# EAGLE design SHABlindRfShield (EAGLE 6.5.0)
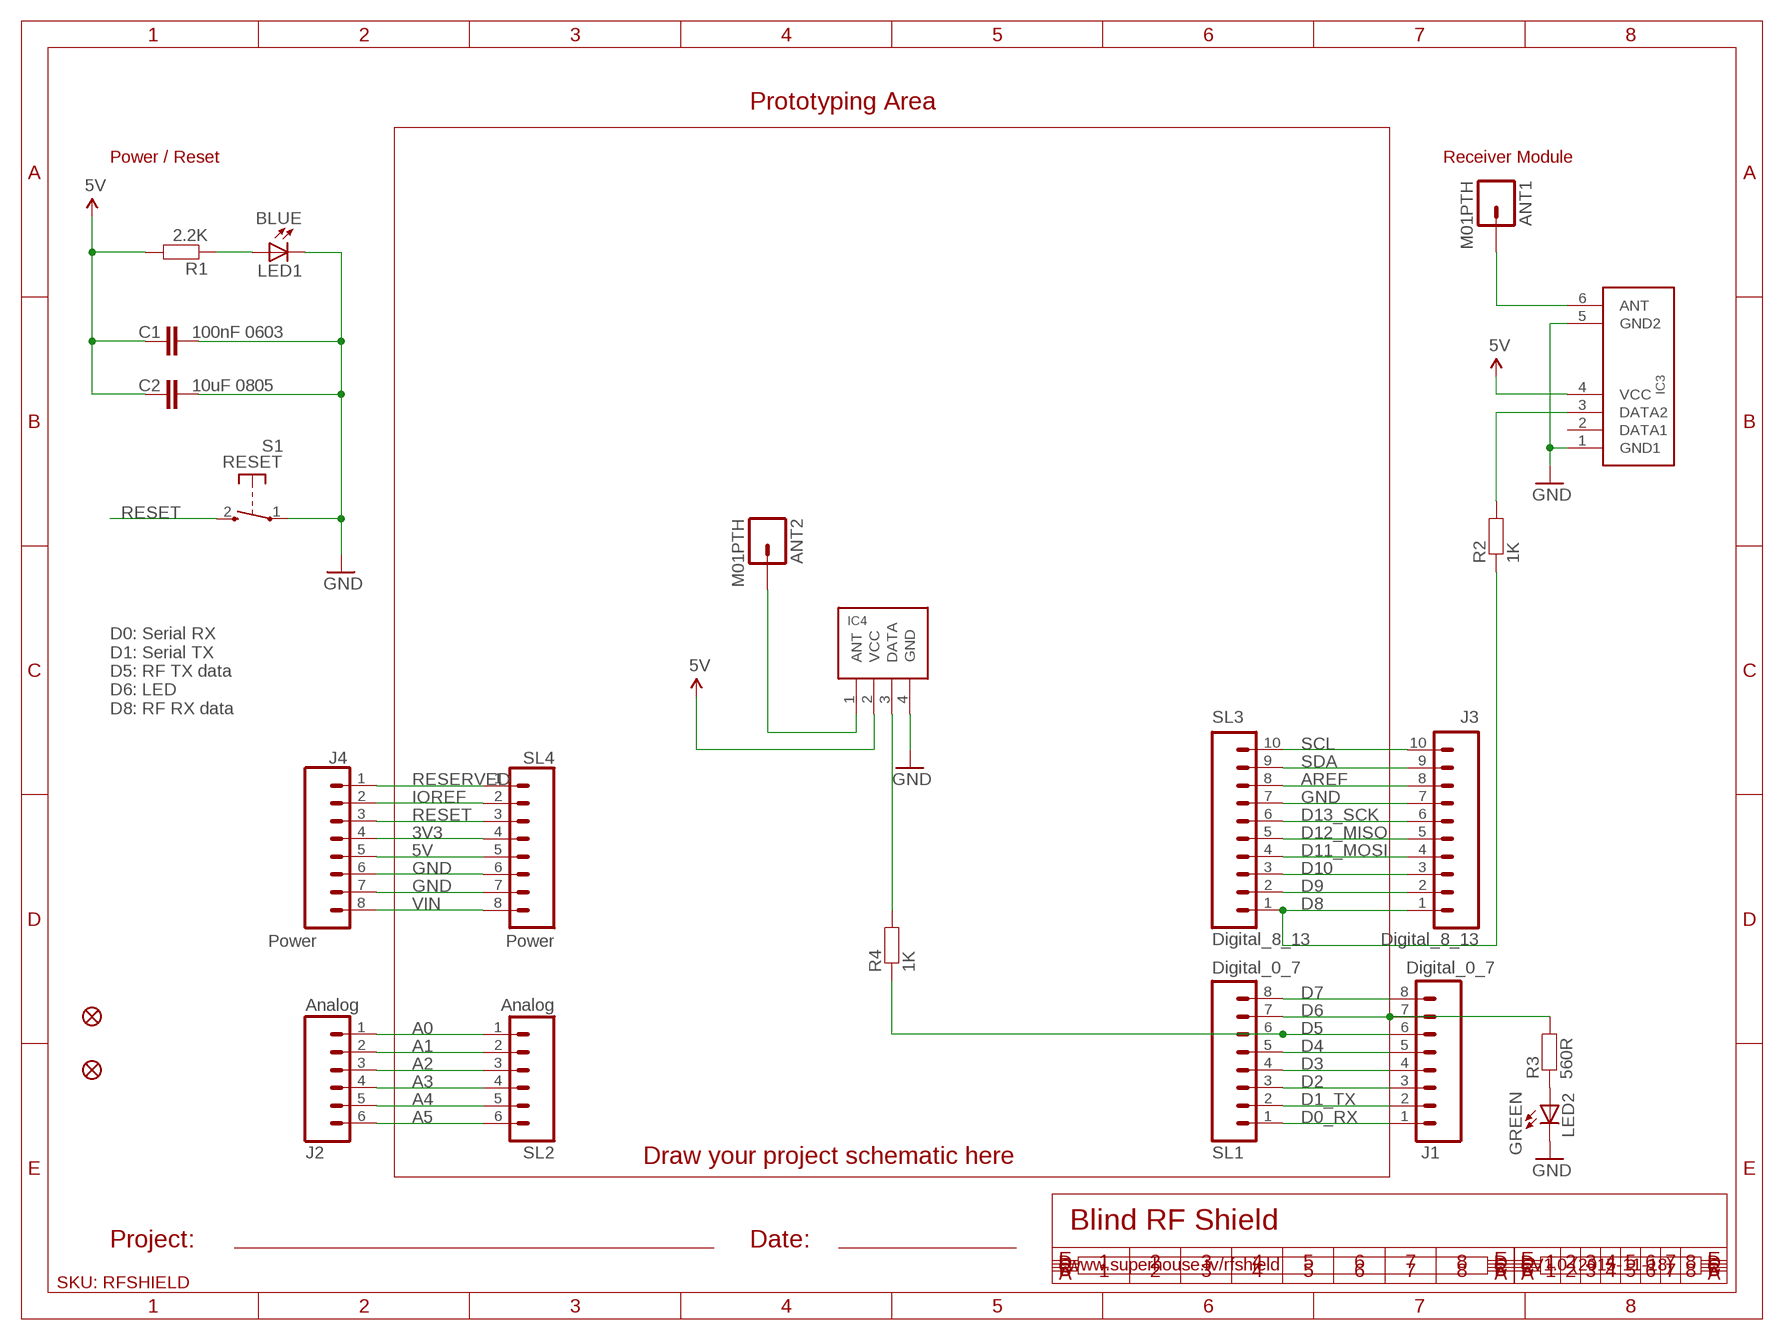
[diagram p0: schematic, sheet 1]

## Parts
ANT1  M01PTH  [1X01]
ANT2  M01PTH  [1X01]
C1  100nF 0603  CAP0603  [0603]
C2  10uF 0805  C-EUC0805  [C0805]
IC3  RXB1  RXB1SHORTFLAT  [RX-B1-SHORT-FLAT]
IC4  TX-C1FLAT  [TX-C1-FLAT]
J1  Digital_0_7  M08  [1X08]
J2  Analog  M06SIP  [1X06]
J3  Digital_8_13  M100.1  [1X10]
J4  Power  M08  [1X08]
LED1  BLUE  LED0603  [LED-0603]
LED2  GREEN  LED0603  [LED-0603]
R1  2.2K  RESISTOR0603  [0603]
R2  1K  RESISTOR0603  [0603]
R3  560R  RESISTOR0603  [0603]
R4  1K  RESISTOR0603  [0603]
S1  RESET  TAC_SWITCH_2PIN  [TACTILE_SWITCH_SMD_2PIN_TINY]
SL1  Digital_0_7  M08  [1X08]
SL2  Analog  M06SIP  [1X06]
SL3  Digital_8_13  M100.1  [1X10]
SL4  Power  M08  [1X08]
U$4  FIDUCIAL1X2.5  [FIDUCIAL-1X2.5]
U$5  FIDUCIAL1X2.5  [FIDUCIAL-1X2.5]

## Nets
3V3: J4.4 SL4.4
5V: C1.1 C2.2 IC3.4(VCC) IC4.2(VCC) J4.5 R1.2 SL4.5
A0: J2.1 SL2.1
A1: J2.2 SL2.2
A2: J2.3 SL2.3
A3: J2.4 SL2.4
A4: J2.5 SL2.5
A5: J2.6 SL2.6
AREF: J3.8 SL3.8
D0_RX: J1.1 SL1.1
D1_TX: J1.2 SL1.2
D2: J1.3 SL1.3
D3: J1.4 SL1.4
D4: J1.5 SL1.5
D5: J1.6 R4.1 SL1.6
D6: J1.7 R3.2 SL1.7
D7: J1.8 SL1.8
D8: J3.1 R2.1 SL3.1
D9: J3.2 SL3.2
D10: J3.3 SL3.3
D11_MOSI: J3.4 SL3.4
D12_MISO: J3.5 SL3.5
D13_SCK: J3.6 SL3.6
GND: C1.2 C2.1 IC3.1(GND1) IC3.5(GND2) IC4.4(GND) J3.7 J4.6 J4.7 LED1.C LED2.C S1.1(P) SL3.7 SL4.6 SL4.7
IOREF: J4.2 SL4.2
N$1: LED1.A R1.1
N$2: LED2.A R3.1
N$3: ANT1.1 IC3.6(ANT)
N$4: ANT2.1 IC4.1(ANT)
N$6: IC4.3(DATA) R4.2
N$135: IC3.3(DATA2) R2.2
RESERVED: J4.1 SL4.1
RESET: J4.3 S1.2(S) SL4.3
SCL: J3.10 SL3.10
SDA: J3.9 SL3.9
VIN: J4.8 SL4.8
Unconnected: IC3.2(DATA1)

## Notes on the sheet
- Prototyping Area
- Power / Reset | Receiver Module
- D0: Serial RX
  D1: Serial TX
  D5: RF TX data
  D6: LED
  D8: RF RX data
- Draw your project schematic here
- Blind RF Shield
- Project: | Date:
- www.superhouse.tv/rfshield | V1.0 (2015-11-18)
- SKU: RFSHIELD

## Library data of the parts
ANT1 ANT2 = freetronics:M01: Header 1 Standard 1-pin 0.1" header. Use with straight break away headers (SKU : PRT-00116), right angle break away headers (PRT-00553), swiss pins (PRT-00743), machine pins (PRT-00117), and female headers (PRT-00115).
C1 = freetronics:CAP: Capacitor Standard 0603 ceramic capacitor, and 0.1" leaded capacitor.
C2 = freetronics-jon:C-EU: CAPACITOR, European symbol
IC3 = freetronics-master-v1:RXB1SHORT
IC4 = freetronics-jon:TX-C1
J1 J4 SL1 SL4 = freetronics:M08: Header 8 Standard 8-pin 0.1" header. Use with straight break away headers (SKU : PRT-00116), right angle break away headers (PRT-00553), swiss pins (PRT-00743), machine pins (PRT-00117), and female headers (PRT-00115).
J2 SL2 = freetronics:M06: Header 6 Standard 6-pin 0.1" header. Use with straight break away headers (SKU : PRT-00116), right angle break away headers (PRT-00553), swiss pins (PRT-00743), machine pins (PRT-00117), and female headers (PRT-00115). Molex polarized connector foot print use with SKU : PRT-08094 with associated crimp pins and housings. NOTES ON THE VARIANTS LOCK and LOCK_LONGPADS... This footprint was designed to help hold the alignment of a through-hole component (i.e. 6-pin header) while soldering it into place. You may notice that each hole has been shifted either up or down by 0.005 of an inch from it's more standard position (which is a perfectly straight line). This slight alteration caused the pins (the squares in the middle) to touch the edges of the holes. Because they are alternating, it causes a "brace" to hold the component in place. 0.005 has proven to be the perfect amount of "off-center" position when using our standard breakaway headers. Although looks a little odd when you look at the bare footprint, once you have a header in there, the alteration is very hard to notice. Also, if you push a header all the way into place, it is covered up entirely on the bottom side. This idea of altering the position of holes to aid alignment will be further integrated into the Sparkfun Library for other footprints. It can help hold any component with 3 or more connection pins.
J3 SL3 = freetronics-original:M10: Header 10 Standard 10-pin 0.1" header. Use with straight break away headers (SKU : PRT-00116), right angle break away headers (PRT-00553), swiss pins (PRT-00743), machine pins (PRT-00117), and female headers (PRT-00115).
LED1 LED2 = freetronics:LED: LEDs Standard schematic elements and footprints for 5mm, 3mm, 1206, and 0603 sized LEDs. 5mm - Spark Fun Electronics SKU : COM-00529 (and others)
R1-R4 = freetronics:RESISTOR: Resistor Basic schematic elements and footprints for 0603, 1206, and PTH 1/10th watt (small) resistors.
S1 = freetronics-jon:TAC_SWITCH_2PIN: Momentary Tactile Switch - 2 pin
U$4 U$5 = freetronics-original:FIDUCIAL: Fiducial Alignment Points Various fiducial points for machine vision alignment.

## Net classes
1 VCC: width 0.305 mm

## Board
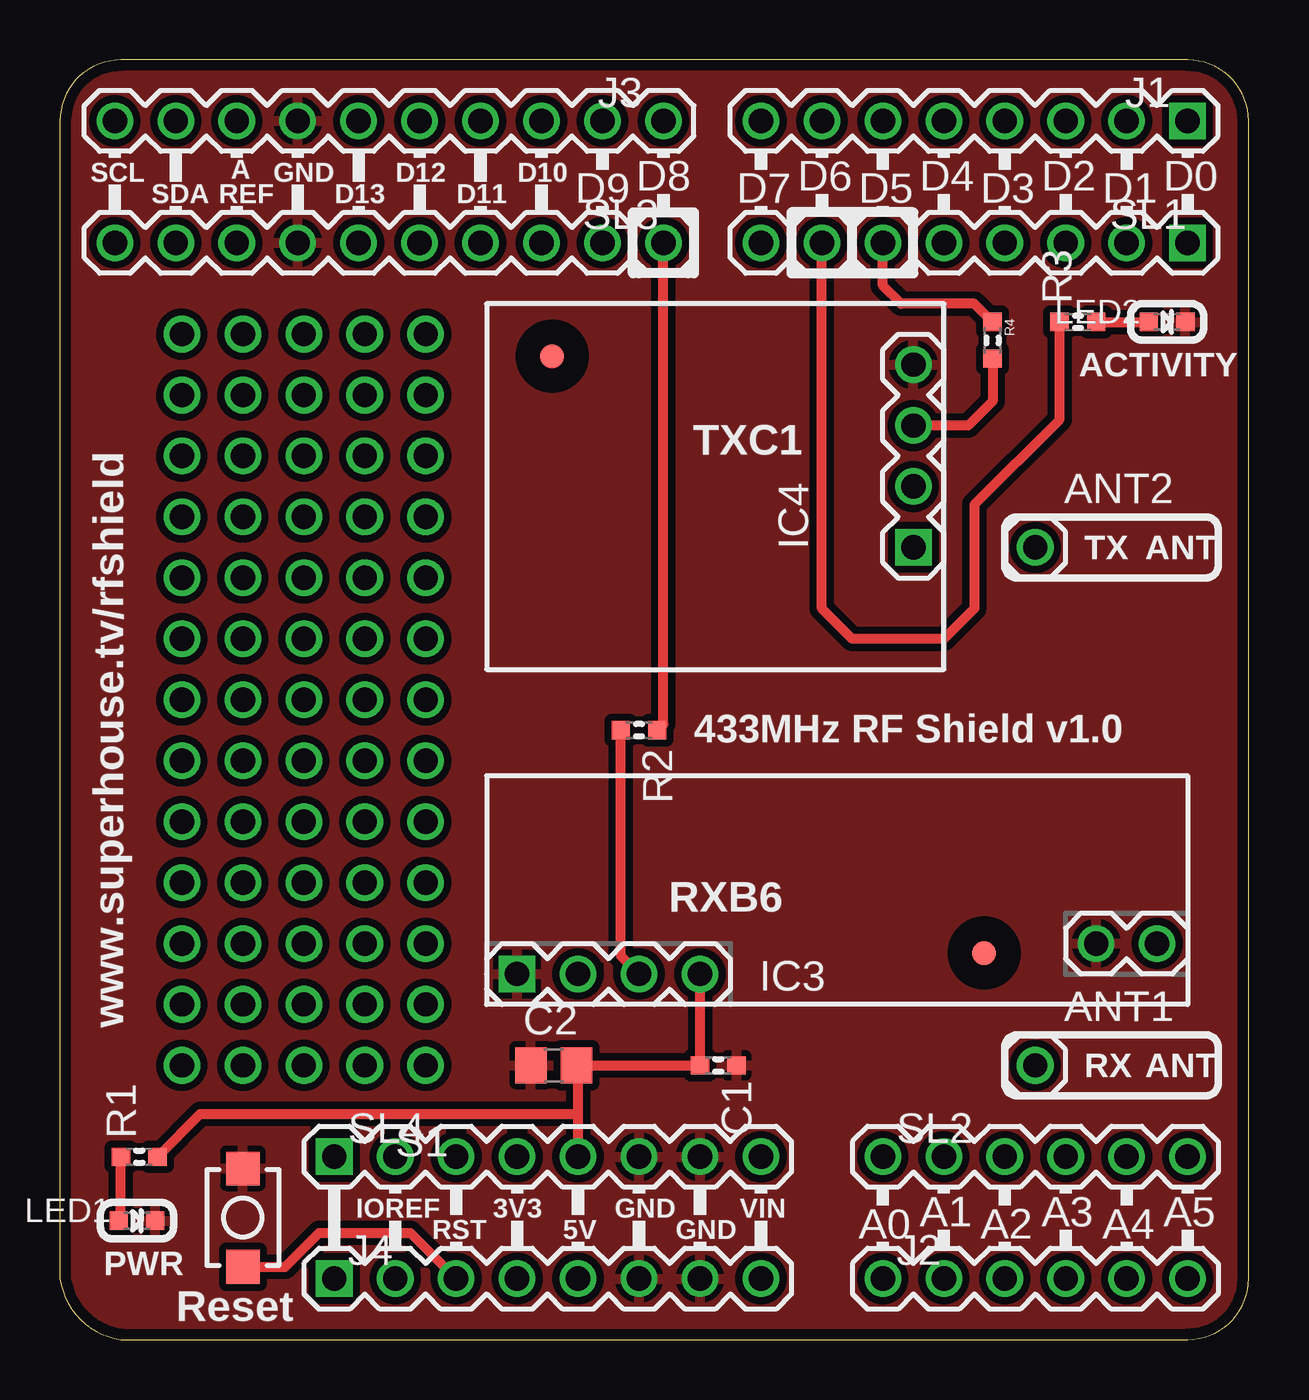
[diagram p1: board, top side]
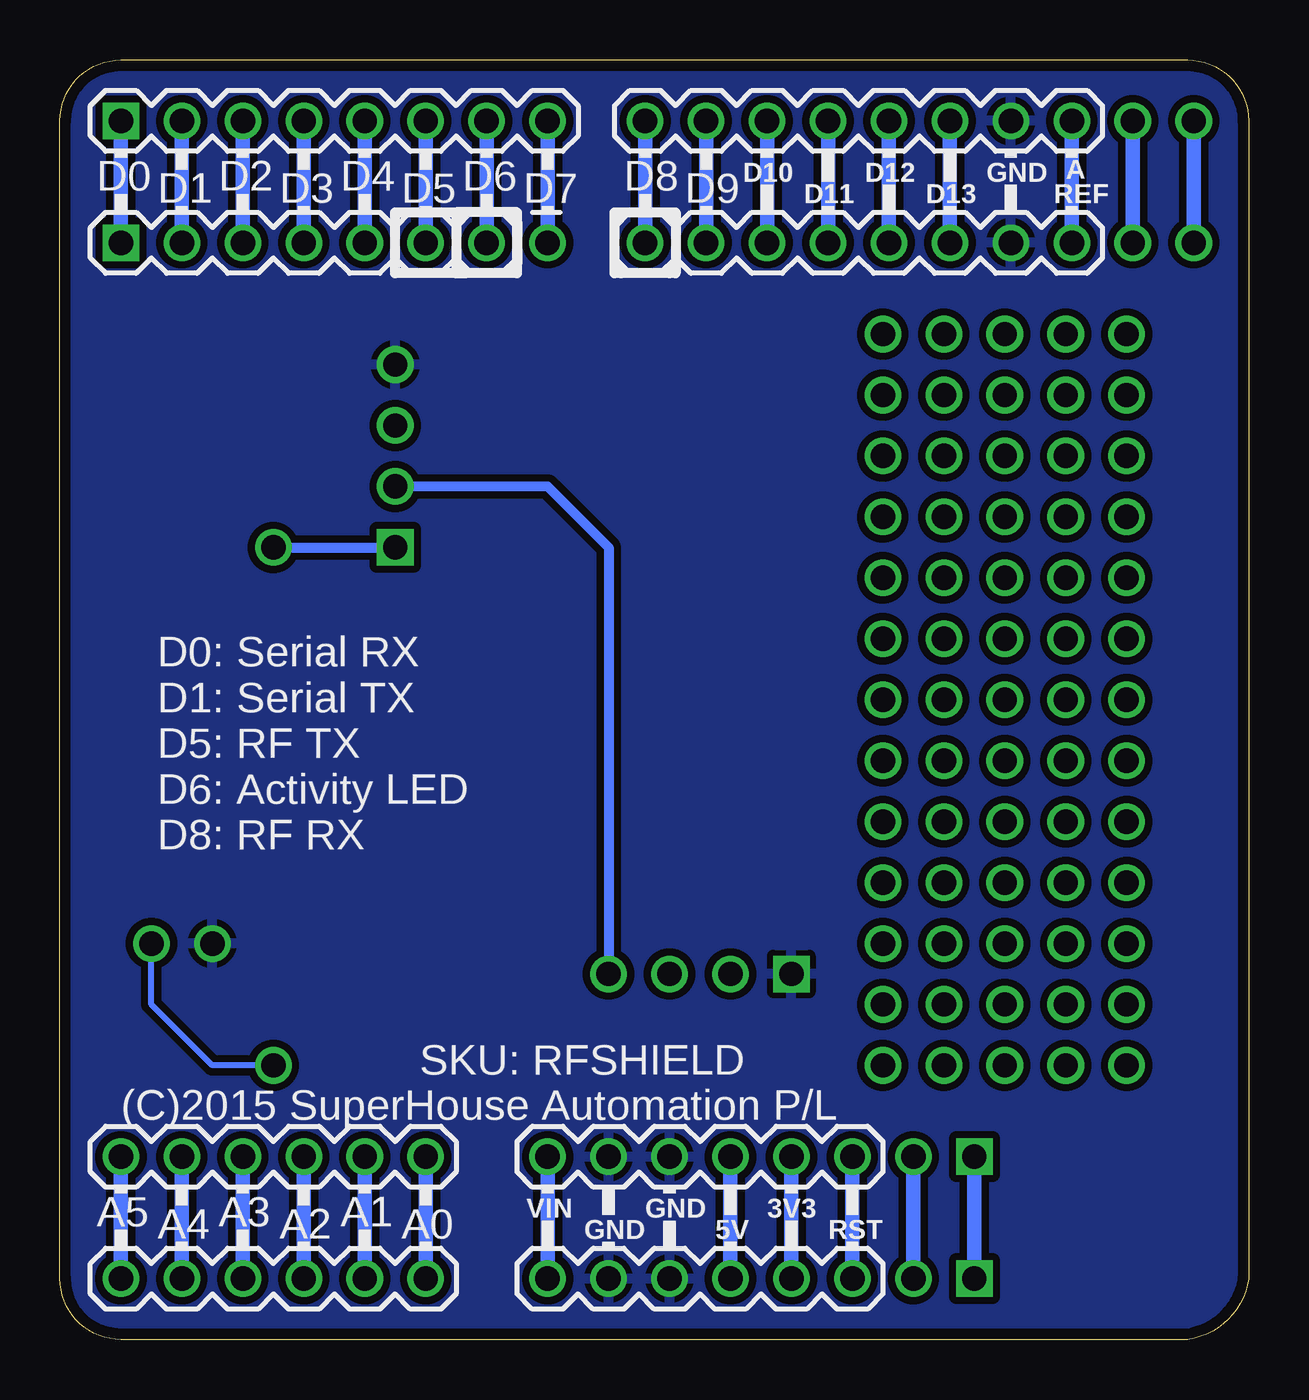
[diagram p2: board, bottom side, seen from below]

Size 49.53 x 53.34 mm. Coordinates in mm from the lower left corner, seen from the top.
Outline: 0,2.54 arc74 2.54,0 46.99,0 arc90 49.53,2.54 49.53,50.8 arc90 46.99,53.34 2.54,53.34 arc90 0,50.8 0,2.54
Copper layers (1*16): Top 0.035mm / dielectric 1.5mm / Bottom 0.035mm
Design rules "default *": minimum track width 10mil, minimum drill 24mil, track to track 12mil, track to pad 12mil, pad to pad 12mil, via to via 12mil, smd to smd 8mil, copper to edge 18mil, drill to drill 8mil, minimum pad ring 10mil, minimum via ring 8mil, stop-mask expansion 4mil, vias tented up to drill 0mil, thermal gap 10mil
tRestrict: area 37.5,15.1 to 39.5,17.1; area 19.5,40 to 21.5,42

### Footprints (pad centres in the part's own frame; a part is rotated, then mirrored left to right if it is on the bottom)
1X01 = drill 1.016: 1 0,0
0603 = smd 0.762 x 0.762: 1 -0.762,0; 2 0.762,0
C0805 = smd 1.3 x 1.5: 1 -0.95,0; 2 0.95,0
RX-B1-SHORT-FLAT = drill 1.016 square: 1 0,0 | drill 1.016: 2 2.54,0; 3 5.08,0; 4 7.62,0; 5 24.13,1.27; 6 26.67,1.27
TX-C1-FLAT = drill 1.016 square: 1 0,0 | drill 1.016: 2 2.54,0; 3 5.08,0; 4 7.62,0
1X08 = drill 1.016 square: 1 0,0 | drill 1.016: 2 2.54,0; 3 5.08,0; 4 7.62,0; 5 10.16,0; 6 12.7,0; 7 15.24,0; 8 17.78,0
1X06 = drill 1.016: 1 0,0; 2 2.54,0; 3 5.08,0; 4 7.62,0; 5 10.16,0; 6 12.7,0
1X10 = drill 1.016: 1 0,0; 2 2.54,0; 3 5.08,0; 4 7.62,0; 5 10.16,0; 6 12.7,0; 7 15.24,0; 8 17.78,0; 9 20.32,0; 10 22.86,0
LED-0603 = smd 0.762 x 0.762: A -0.762,0; C 0.762,0
TACTILE_SWITCH_SMD_2PIN_TINY = smd 1.4 x 1.4: 1 -2.05,0; 2 2.05,0
FIDUCIAL-1X2.5 = smd 1 x 1: 1 0,0

### Placement (x,y rotation side)
ANT1  40.64,11.43 0 top
ANT2  40.64,33.02 0 top
C1  27.43,11.43 0 top
C2  20.57,11.43 0 top
IC3  19.05,15.24 0 top
IC4  35.56,33.02 90 top
J1  46.99,50.8 180 top
J2  34.29,2.54 0 top
J3  25.15,50.8 180 top
J4  11.43,2.54 0 top
LED1  3.21,4.95 0 top
LED2  46.13,42.42 0 top
R1  3.3,7.62 0 top
R2  24.13,25.4 180 top
R3  42.42,42.42 180 top
R4  38.86,41.66 270 top
S1  7.62,5.08 270 top
SL1  46.99,45.72 180 top
SL2  34.29,7.62 0 top
SL3  25.15,45.72 180 top
SL4  11.43,7.62 0 top
U$4  38.51,16.11 270 top
U$5  20.51,40.99 270 top

### Tracks (layer width: path | path; a pad name or v marks a point on that pad's centre or on a via)
3V3
  Bottom 0.61: SL4.4 J4.4
5V
  Top 0.406: SL4.5 21.59,9.4 | 21.59,9.4 21.59,11.36 C2.2 C1.1 IC3.4 | R1.2 5.84,9.4 21.59,9.4
  Bottom 0.406: IC3.4 26.67,33.02 29.21,35.56 IC4.2
  Bottom 0.61: J4.5 SL4.5
A0
  Bottom 0.61: SL2.1 J2.1
A1
  Bottom 0.61: SL2.2 J2.2
A2
  Bottom 0.61: SL2.3 J2.3
A3
  Bottom 0.61: SL2.4 J2.4
A4
  Bottom 0.61: SL2.5 J2.5
A5
  Bottom 0.61: SL2.6 J2.6
AREF
  Bottom 0.61: J3.8 SL3.8
D0_RX
  Bottom 0.61: SL1.1 J1.1
D1_TX
  Bottom 0.61: SL1.2 J1.2
D2
  Bottom 0.61: SL1.3 J1.3
D3
  Bottom 0.61: SL1.4 J1.4
D4
  Bottom 0.61: SL1.5 J1.5
D5
  Top 0.406: SL1.6 34.29,43.94 35.05,43.18 38.1,43.18 R4.1
  Bottom 0.61: SL1.6 J1.6
D6
  Top 0.406: SL1.7 31.75,30.48 33.02,29.21 36.83,29.21 38.1,30.48 38.1,34.8 41.66,38.35 R3.2
  Bottom 0.61: SL1.7 J1.7
D7
  Bottom 0.61: SL1.8 J1.8
D8
  Top 0.406: R2.1 25.15,25.65 SL3.1
  Bottom 0.61: J3.1 SL3.1
D9
  Bottom 0.61: J3.2 SL3.2
D10
  Bottom 0.61: J3.3 SL3.3
D11_MOSI
  Bottom 0.61: J3.4 SL3.4
D12_MISO
  Bottom 0.61: J3.5 SL3.5
D13_SCK
  Bottom 0.61: J3.6 SL3.6
GND
  pour Bottom: 0,2.54 0,50.8 arc-90 2.54,53.34 46.99,53.34 arc-74 49.53,50.8 49.53,40.64 49.53,2.54 arc-74 46.99,0 2.54,0 arc-74
  pour Top: 0,2.54 0,50.8 arc-90 2.54,53.34 46.99,53.34 arc-74 49.53,50.8 49.53,40.64 49.53,2.54 arc-74 46.99,0 2.54,0 arc-74
IOREF
  Bottom 0.61: SL4.2 J4.2
N$1
  Top 0.406: LED1.A 2.54,5.05 R1.1
N$2
  Top 0.406: R3.1 LED2.A
N$3
  Bottom 0.254: ANT1.1 43.18,11.43 45.72,13.97 IC3.6
N$4
  Bottom 0.406: ANT2.1 IC4.1
N$6
  Top 0.406: R4.2 38.86,39.12 37.85,38.1 IC4.3
N$7  (via drill 1.02)
  other vias: 10.16,11.43
N$8  (via drill 1.02)
  other vias: 10.16,13.97
N$9  (via drill 1.02)
  other vias: 10.16,16.51
N$10  (via drill 1.02)
  other vias: 10.16,19.05
N$11  (via drill 1.02)
  other vias: 10.16,21.59
N$12  (via drill 1.02)
  other vias: 10.16,24.13
N$13  (via drill 1.02)
  other vias: 10.16,26.67
N$14  (via drill 1.02)
  other vias: 10.16,29.21
N$15  (via drill 1.02)
  other vias: 12.7,11.43
N$16  (via drill 1.02)
  other vias: 12.7,13.97
N$17  (via drill 1.02)
  other vias: 12.7,16.51
N$18  (via drill 1.02)
  other vias: 12.7,19.05
N$19  (via drill 1.02)
  other vias: 12.7,21.59
N$20  (via drill 1.02)
  other vias: 12.7,24.13
N$21  (via drill 1.02)
  other vias: 12.7,26.67
N$22  (via drill 1.02)
  other vias: 12.7,29.21
N$23  (via drill 1.02)
  other vias: 10.16,31.75
N$24  (via drill 1.02)
  other vias: 10.16,34.29
N$25  (via drill 1.02)
  other vias: 10.16,36.83
N$26  (via drill 1.02)
  other vias: 12.7,31.75
N$27  (via drill 1.02)
  other vias: 12.7,34.29
N$28  (via drill 1.02)
  other vias: 12.7,36.83
N$29  (via drill 1.02)
  other vias: 15.24,11.43
N$30  (via drill 1.02)
  other vias: 15.24,13.97
N$31  (via drill 1.02)
  other vias: 15.24,16.51
N$32  (via drill 1.02)
  other vias: 15.24,19.05
N$33  (via drill 1.02)
  other vias: 15.24,21.59
N$34  (via drill 1.02)
  other vias: 15.24,24.13
N$35  (via drill 1.02)
  other vias: 15.24,26.67
N$36  (via drill 1.02)
  other vias: 15.24,29.21
N$37  (via drill 1.02)
  other vias: 15.24,31.75
N$38  (via drill 1.02)
  other vias: 15.24,34.29
N$39  (via drill 1.02)
  other vias: 15.24,36.83
N$40  (via drill 1.02)
  other vias: 5.08,39.37
N$41  (via drill 1.02)
  other vias: 5.08,41.91
N$42  (via drill 1.02)
  other vias: 7.62,39.37
N$43  (via drill 1.02)
  other vias: 7.62,41.91
N$44  (via drill 1.02)
  other vias: 10.16,39.37
N$45  (via drill 1.02)
  other vias: 10.16,41.91
N$46  (via drill 1.02)
  other vias: 12.7,39.37
N$47  (via drill 1.02)
  other vias: 12.7,41.91
N$48  (via drill 1.02)
  other vias: 15.24,39.37
N$49  (via drill 1.02)
  other vias: 15.24,41.91
N$135
  Top 0.406: IC3.3 23.37,16 R2.2
N$161  (via drill 1.02)
  other vias: 5.08,31.75
N$162  (via drill 1.02)
  other vias: 5.08,34.29
N$163  (via drill 1.02)
  other vias: 5.08,36.83
N$164  (via drill 1.02)
  other vias: 7.62,31.75
N$165  (via drill 1.02)
  other vias: 7.62,34.29
N$166  (via drill 1.02)
  other vias: 7.62,36.83
N$182  (via drill 1.02)
  other vias: 5.08,11.43
N$183  (via drill 1.02)
  other vias: 5.08,13.97
N$184  (via drill 1.02)
  other vias: 5.08,16.51
N$185  (via drill 1.02)
  other vias: 5.08,19.05
N$186  (via drill 1.02)
  other vias: 5.08,21.59
N$187  (via drill 1.02)
  other vias: 5.08,24.13
N$188  (via drill 1.02)
  other vias: 5.08,26.67
N$189  (via drill 1.02)
  other vias: 5.08,29.21
N$193  (via drill 1.02)
  other vias: 7.62,11.43
N$194  (via drill 1.02)
  other vias: 7.62,13.97
N$195  (via drill 1.02)
  other vias: 7.62,16.51
N$196  (via drill 1.02)
  other vias: 7.62,19.05
N$197  (via drill 1.02)
  other vias: 7.62,21.59
N$198  (via drill 1.02)
  other vias: 7.62,24.13
N$199  (via drill 1.02)
  other vias: 7.62,26.67
N$200  (via drill 1.02)
  other vias: 7.62,29.21
RESERVED
  Bottom 0.61: SL4.1 J4.1
RESET
  Top 0.406: S1.2 9.38,3.03 10.79,4.45 14.61,4.45 J4.3
  Bottom 0.61: SL4.3 J4.3
SCL
  Bottom 0.61: J3.10 SL3.10
SDA
  Bottom 0.61: J3.9 SL3.9
VIN
  Bottom 0.61: J4.8 SL4.8

### Text on the board
tPlace: SCL | A | GND | D12 | D10 | D8 | D6 | D4 | D2 | D0 | SDA | REF | D13 | D11 | D9 | D7 | D5 | D3 | D1 | ACTIVITY | TXC1 | TX | ANT | 433MHz RF Shield v1.0 | RXB6 | www.superhouse.tv/rfshield | RX | ANT | IOREF | 3V3 | GND | VIN | A1 | A3 | A5 | RST | 5V | GND | A0 | A2 | A4 | PWR | Reset
bPlace: A | GND | D12 | D10 | D8 | D6 | D4 | D2 | D0 | REF | D13 | D11 | D9 | D7 | D5 | D3 | D1 | D0: Serial RX / D1: Serial TX / D5: RF TX / D6: Activity LED / D8: RF RX | SKU: RFSHIELD | (C)2015 SuperHouse Automation P/L | 3V3 | GND | VIN | A1 | A3 | A5 | RST | 5V | GND | A0 | A2 | A4
tNames: S1